# Altium schematic sheet Seguidordelinea.SchDoc
size A4; PageSetup: Record=PageOptions|CenterHorizontal=True|CenterVertical=True|PrintScale=0.97|XCorrection=1.00|YCorrection=1.00|PrintKind=0|BorderSize=5000000|LeftOffset=0|BottomOffset=0|Orientation=2|PaperLength=1000|PaperWidth=1000|Scale=100|PaperSource=7|PrintQuality=-4|MediaType=1|DitherType=10|PaperKind=A4|PrintScaleMode=1
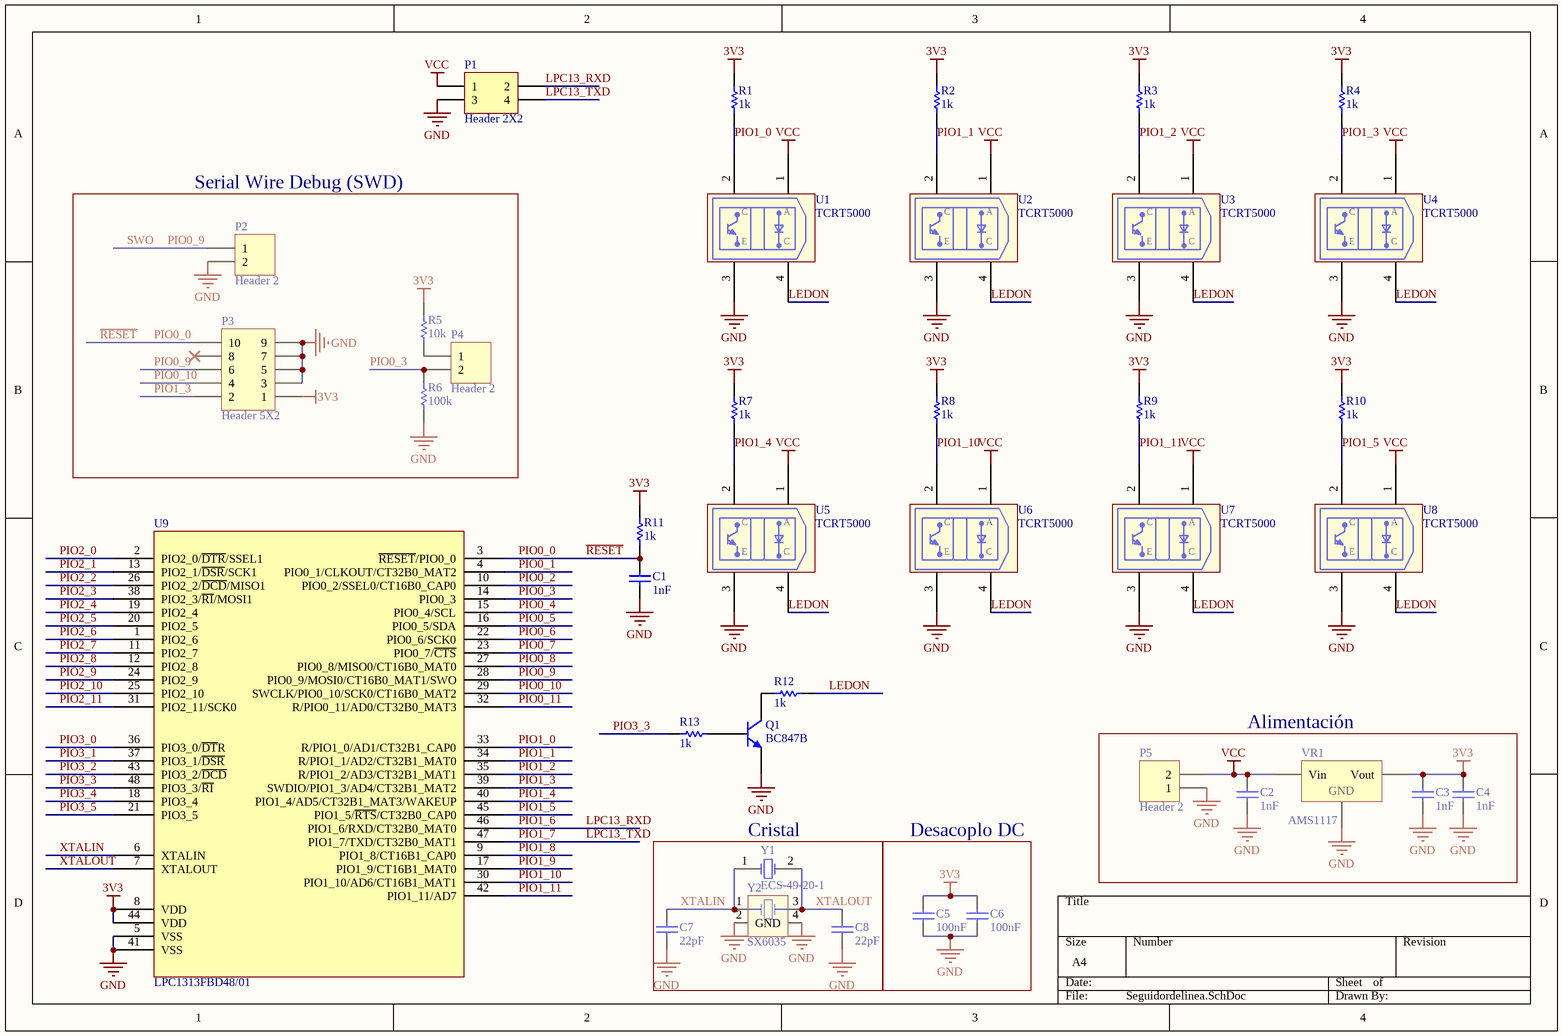
[diagram p0: Seguidordelinea.SchDoc]

## Parts
C1  value 1nF  [0805_CAP]  (hidden comment: Capacitor)
C2  value 1nF  [0805_CAP]  (hidden comment: Capacitor)
C3  value 1nF  [0805_CAP]  (hidden comment: Capacitor)
C4  value 1nF  [0805_CAP]  (hidden comment: Capacitor)
C5  value 100nF  [0805_CAP]  (hidden comment: Capacitor)
C6  value 100nF  [0805_CAP]  (hidden comment: Capacitor)
C7  value 22pF  [0805_CAP]  (hidden comment: Capacitor)
C8  value 22pF  [0805_CAP]  (hidden comment: Capacitor)
P1  Header 2X2  [HDR2X2]
P2  Header 2  [HDR1X2]
P3  Header 5X2  [HDR2X5]
P4  Header 2  [HDR1X2]
P5  Header 2  [HDR1X2]
Q1  BC847B  [SOT23]
R1  value 1k  [0805_RES]  (hidden comment: Resistor)
R2  value 1k  [0805_RES]  (hidden comment: Resistor)
R3  value 1k  [0805_RES]  (hidden comment: Resistor)
R4  value 1k  [0805_RES]  (hidden comment: Resistor)
R5  value 10k  [0805_RES]  (hidden comment: Resistor)
R6  value 100k  [0805_RES]  (hidden comment: Resistor)
R7  value 1k  [0805_RES]  (hidden comment: Resistor)
R8  value 1k  [0805_RES]  (hidden comment: Resistor)
R9  value 1k  [0805_RES]  (hidden comment: Resistor)
R10  value 1k  [0805_RES]  (hidden comment: Resistor)
R11  value 1k  [0805_RES]  (hidden comment: Resistor)
R12  value 1k  [0805_RES]  (hidden comment: Resistor)
R13  value 1k  [0805_RES]  (hidden comment: Resistor)
U1  TCRT5000  [TCRT5000]
U2  TCRT5000  [TCRT5000]
U3  TCRT5000  [TCRT5000]
U4  TCRT5000  [TCRT5000]
U5  TCRT5000  [TCRT5000]
U6  TCRT5000  [TCRT5000]
U7  TCRT5000  [TCRT5000]
U8  TCRT5000  [TCRT5000]
U9  LPC1313FBD48/01  [TQFP48_LPC1343]
VR1  AMS1117  [SOT-223 - M3]
Y1  ECS-49-20-1  [HC-49U]
Y2  SX6035  [SX6035]

## Blocks framed on the sheet
Serial Wire Debug (SWD): P2-P4 R5 R6
Alimentación: C2-C4 P5 VR1
Cristal: C7 C8 Y1 Y2
Desacoplo DC: C5 C6

## Nets
3V3: C3.2 C4.2 C5.2 C6.2 P3.1 R1.1 R2.1 R3.1 R4.1 R5.1 R7.1 R8.1 R9.1 R10.1 R11.2 U9.8(VDD) U9.44(VDD) VR1.2(Vout)
GND: C1.1 C2.1 C3.1 C4.1 C5.1 C6.1 C7.1 C8.2 P1.3 P2.2 P3.3 P3.5 P3.7 P3.9 P5.1 Q1.2(E) R6.2 U1.3(E) U2.3(E) U3.3(E) U4.3(E) U5.3(E) U6.3(E) U7.3(E) U8.3(E) U9.5(VSS) U9.41(VSS) VR1.1(GND) Y2.2(GND) Y2.4(GND)
VCC: C2.2 P1.1 P5.2 U1.1(A) U2.1(A) U3.1(A) U4.1(A) U5.1(A) U6.1(A) U7.1(A) U8.1(A) VR1.3(Vin)
~{RESET}: C1.2 P3.10 R11.1 U9.3(~{RESET}/PIO0_0)  [also labelled PIO0_0]
LEDON: R12.2 U1.4(C) U2.4(C) U3.4(C) U4.4(C) U5.4(C) U6.4(C) U7.4(C) U8.4(C)
LPC13_RXD: P1.2 U9.46(PIO1_6/RXD/CT32B0_MAT0)  [also labelled PIO1_6]
LPC13_TXD: P1.4 U9.47(PIO1_7/TXD/CT32B0_MAT1)  [also labelled PIO1_7]
PIO0_1: U9.4(PIO0_1/CLKOUT/CT32B0_MAT2)
PIO0_2: U9.10(PIO0_2/SSEL0/CT16B0_CAP0)
PIO0_3: P4.2 R6.1 U9.14(PIO0_3)
PIO0_4: U9.15(PIO0_4/SCL)
PIO0_5: U9.16(PIO0_5/SDA)
PIO0_6: U9.22(PIO0_6/SCK0)
PIO0_7: U9.23(PIO0_7/~{CTS})
PIO0_8: U9.27(PIO0_8/MISO0/CT16B0_MAT0)
PIO0_9: P2.1 P3.6 U9.28(PIO0_9/MOSI0/CT16B0_MAT1/SWO)  [also labelled SWO]
PIO0_10: P3.4 U9.29(SWCLK/PIO0_10/SCK0/CT16B0_MAT2)
PIO0_11: U9.32(R/PIO0_11/AD0/CT32B0_MAT3)
PIO1_0: R1.2 U1.2(C) U9.33(R/PIO1_0/AD1/CT32B1_CAP0)
PIO1_1: R2.2 U2.2(C) U9.34(R/PIO1_1/AD2/CT32B1_MAT0)
PIO1_2: R3.2 U3.2(C) U9.35(R/PIO1_2/AD3/CT32B1_MAT1)
PIO1_3: P3.2 R4.2 U4.2(C) U9.39(SWDIO/PIO1_3/AD4/CT32B1_MAT2)
PIO1_4: R7.2 U5.2(C) U9.40(PIO1_4/AD5/CT32B1_MAT3/WAKEUP)
PIO1_5: R10.2 U8.2(C) U9.45(PIO1_5/~{RTS}/CT32B0_CAP0)
PIO1_8: U9.9(PIO1_8/CT16B1_CAP0)
PIO1_9: U9.17(PIO1_9/CT16B1_MAT0)
PIO1_10: R8.2 U6.2(C) U9.30(PIO1_10/AD6/CT16B1_MAT1)
PIO1_11: R9.2 U7.2(C) U9.42(PIO1_11/AD7)
PIO2_0: U9.2(PIO2_0/~{DTR}/SSEL1)
PIO2_1: U9.13(PIO2_1/~{DSR}/SCK1)
PIO2_2: U9.26(PIO2_2/~{DCD}/MISO1)
PIO2_3: U9.38(PIO2_3/~{RI}/MOSI1)
PIO2_4: U9.19(PIO2_4)
PIO2_5: U9.20(PIO2_5)
PIO2_6: U9.1(PIO2_6)
PIO2_7: U9.11(PIO2_7)
PIO2_8: U9.12(PIO2_8)
PIO2_9: U9.24(PIO2_9)
PIO2_10: U9.25(PIO2_10)
PIO2_11: U9.31(PIO2_11/SCK0)
PIO3_0: U9.36(PIO3_0/~{DT}R)
PIO3_1: U9.37(PIO3_1/~{DSR})
PIO3_2: U9.43(PIO3_2/~{DCD})
PIO3_3: R13.1 U9.48(PIO3_3/~{RI})
PIO3_4: U9.18(PIO3_4)
PIO3_5: U9.21(PIO3_5)
XTALIN: C7.2 U9.6(XTALIN) Y1.1(OSC1) Y2.1(XTAL)
XTALOUT: C8.1 U9.7(XTALOUT) Y1.2(OSC2) Y2.3(XTAL)
NetP4_1: P4.1 R5.2
NetQ1_1: Q1.1(B) R13.2
NetQ1_3: Q1.3(C) R12.1

Not connected (* = marked no-connect by the designer): P3 8*

## Library data of the parts
C1-C8 = Cap
P1 = Header 2X2: Header, 2-Pin, Dual row; LatestRevisionDate: 17-Jul-2002; LatestRevisionNote: Re-released for DXP Platform.; Publisher: Altium Limited
P2 P4 P5 = Header 2: Header, 2-Pin; LatestRevisionDate: 17-Jul-2002; LatestRevisionNote: Re-released for DXP Platform.; Publisher: Altium Limited
P3 = Header 5X2: Header, 5-Pin, Dual row; LatestRevisionDate: 17-Jul-2002; LatestRevisionNote: Re-released for DXP Platform.; Publisher: Altium Limited
Q1 = BC847B: NPN 100MHz
R1-R13 = Res
U9 = LPC1313FBD48/01: ARM CortexM3 32K Flash, 8k RAM
VR1 = AMS1117: Voltage Regulator; Published: 24-Mar-1999; LatestRevisionDate: 29-May-2009; LatestRevisionNote: IPC-7351 Footprint Added.; PackageReference: D2PAK; Publisher: Altium Limited; PackageDescription: 3-Pin Transistor Outline Package 2.54 mm Pitch, 15.1 mm Lead Span
Y1 = ECS-49-20-1: Crystal Oscillator; Published: 17-Jul-2002; DatasheetDocument: 18-Apr-2000; PackageReference: HC-49U; Publisher: Altium Limited; ComponentLink1Description: Manufacturer Link; ComponentLink1URL: http://www.ecsxtal.com/; ComponentLink2Description: Datasheet; ComponentLink2URL: http://www.ecsxtal.com/pdf2/HC49U.PDF
Y2 = XTAL_SX6035